# EAGLE design fUENTE 5 VOLTS (EAGLE 5.07)
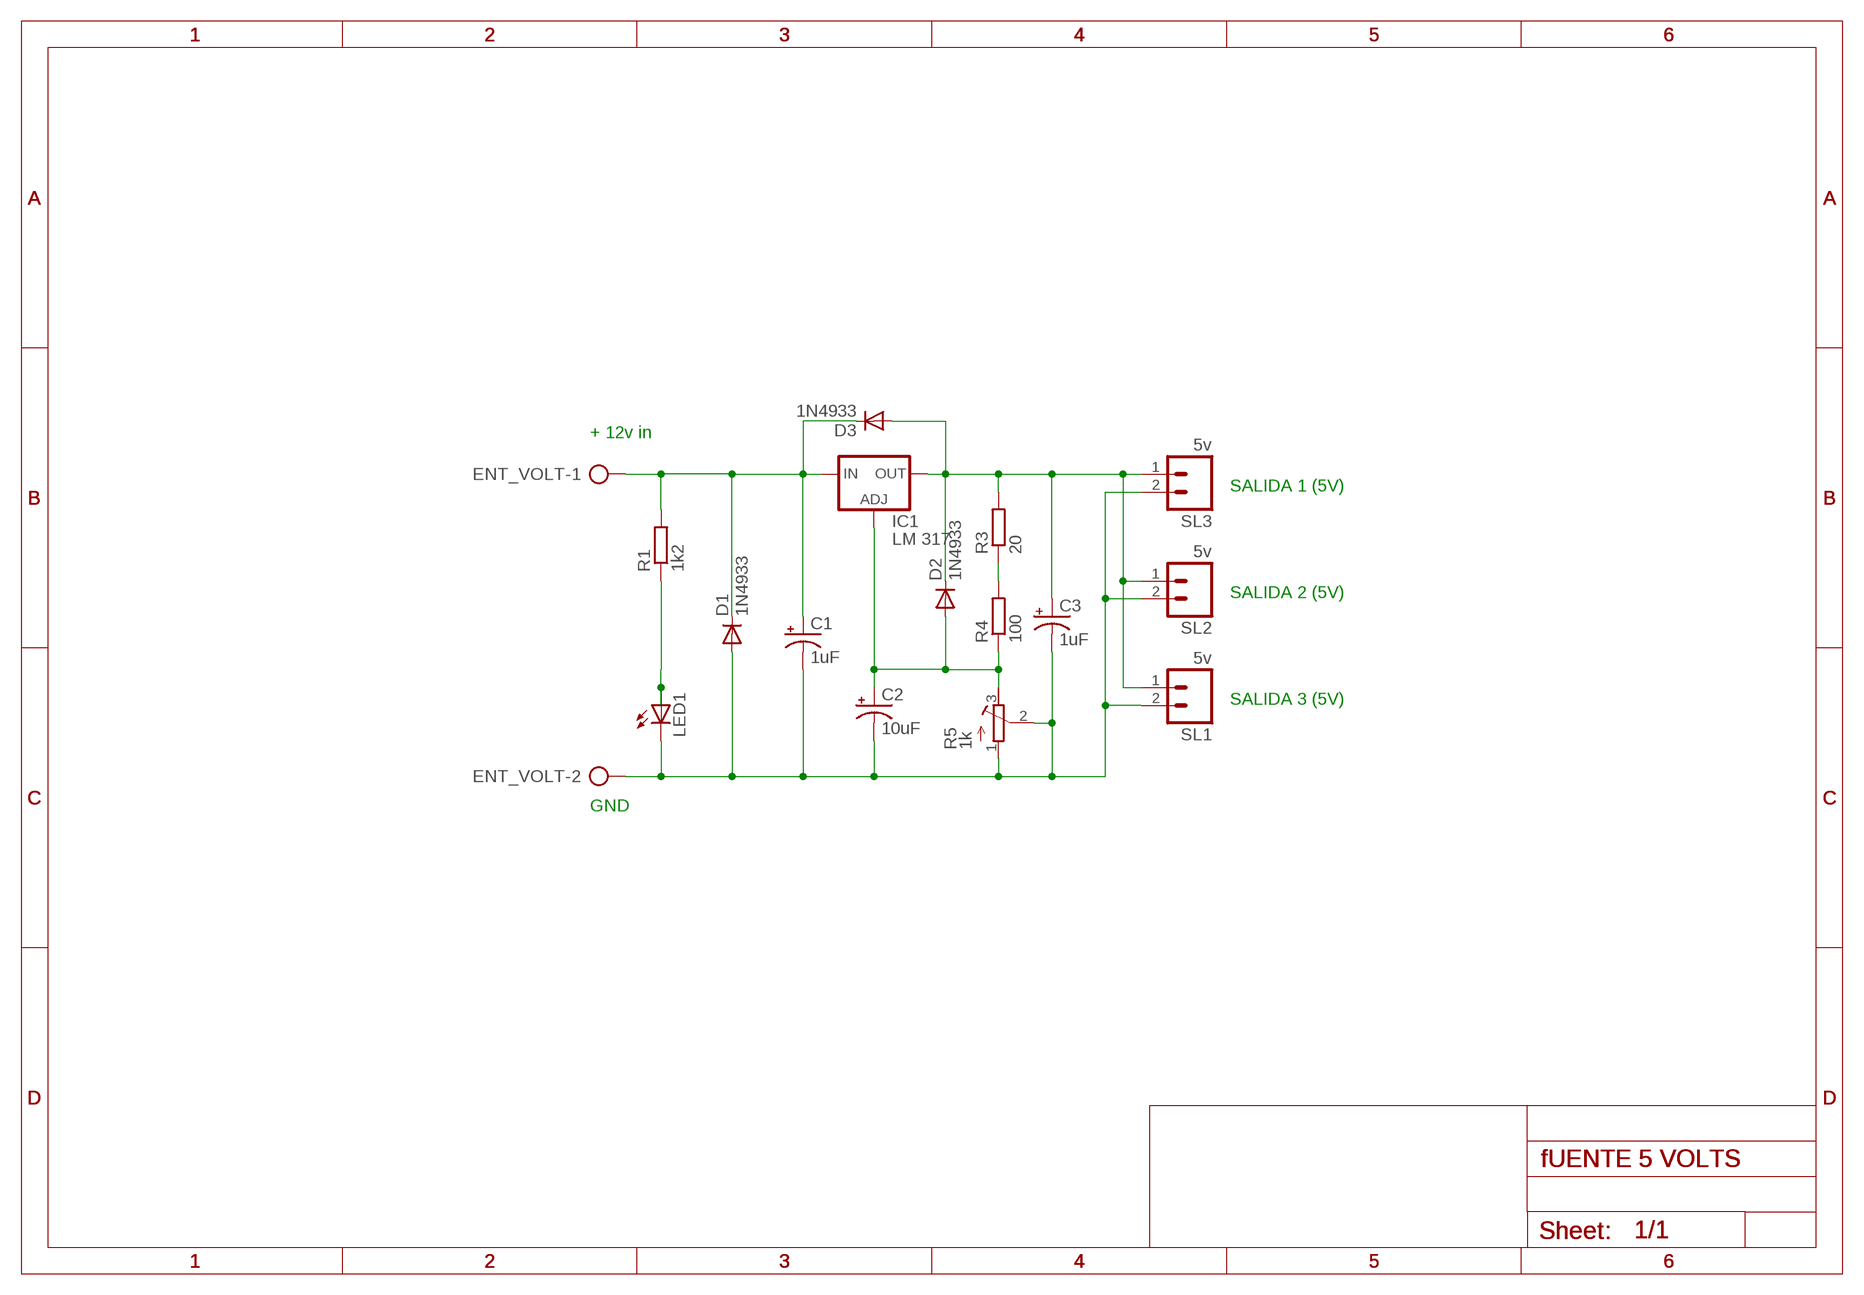
[diagram p0: schematic, sheet 1]

## Parts
C1  1uF  CPOL-USE3.5-8  [E3,5-8]
C2  10uF  CPOL-USE3.5-8  [E3,5-8]
C3  1uF  CPOL-USE3.5-8  [E3,5-8]
D1  1N4933  [DO41-10]
D2  1N4933  [DO41-10]
D3  1N4933  [DO41-10]
ENT_VOLT  AK300/2  [AK300/2]
IC1  LM 317  LM317-TO3  [TO3-K02]
LED1  LED3MM  [LED3MM]
R1  1k2  R-EU_0207/10  [0207/10]
R3  20  R-EU_0207/10  [0207/10]
R4  100  R-EU_0207/10  [0207/10]
R5  1k  R-TRIMM64W  [RTRIM64W]
SL1  5v  M02  [02P]
SL2  5v  M02  [02P]
SL3  5v  M02  [02P]

## Nets
5V: C3.+ D2.C D3.A IC1.3(OUT) R3.2 SL1.1 SL2.1 SL3.1
12V: C1.+ D1.C D3.C ENT_VOLT.1 IC1.1(IN) R1.2
ADJ: C2.+ D2.A IC1.2(ADJ) R4.1 R5.3(A)
GND: C1.- C2.- C3.- D1.A ENT_VOLT.2 LED1.K(C) R5.1(E) R5.2(S) SL1.2 SL2.2 SL3.2
N$1: R3.1 R4.2
N$4: LED1.A R1.1

## Notes on the sheet
- + 12v in
- SALIDA 1 (5V)
- SALIDA 2 (5V)
- SALIDA 3 (5V)
- GND

## Library data of the parts
C1-C3 = rcl:CPOL-US: POLARIZED CAPACITOR, American symbol
D1-D3 = diode:1N4933: DIODE fast recovery rectifier, 1A
ENT_VOLT = con-ptr500:AK300/2: CONNECTOR
IC1 = v-reg:LM317-TO3: VOLTAGE REGULATOR
LED1 = led:LED: LED OSRAM: - CHIPLED LG R971, LG N971, LY N971, LG Q971, LY Q971, LO R971, LY R971 LH N974, LH R974 LS Q976, LO Q976, LY Q976 LO Q996 - Hyper CHIPLED LW Q18S LB Q993, LB Q99A, LB R99A - SideLED LS A670, LO A670, LY A670, LG A670, LP A670 LB A673, LV A673, LT A673, LW A673 LH A674 LY A675 LS A676, LA A676, LO A676, LY A676, LW A676 LS A679, LY A679, LG A679 - Hyper Micro SIDELED® LS Y876, LA Y876, LO Y876, LY Y876 LT Y87S - SmartLED LW L88C, LW L88S LB L89C, LB L89S, LG L890 LS L89K, LO L89K, LY L89K LS L896, LA L896, LO L896, LY L896 - TOPLED LS T670, LO T670, LY T670, LG T670, LP T670 LSG T670, LSP T670, LSY T670, LOP T670, LYG T670 LG T671, LOG T671, LSG T671 LB T673, LV T673, LT T673, LW T673 LH T674 LS T676, LA T676, LO T676, LY T676, LB T676, LH T676, LSB T676, LW T676 LB T67C, LV T67C, LT T67C, LS T67K, LO T67K, LY T67K, LW E67C LS E67B, LA E67B, LO E67B, LY E67B, LB E67C, LV E67C, LT E67C LW T67C LS T679, LY T679, LG T679 LS T770, LO T770, LY T770, LG T770, LP T770 LB T773, LV T773, LT T773, LW T773 LH T774 LS E675, LA E675, LY E675, LS T675 LS T776, LA T776, LO T776, LY T776, LB T776 LHGB T686 LT T68C, LB T68C - Hyper Mini TOPLED® LB M676 - Mini TOPLED Santana® LG M470 LS M47K, LO M47K, LY M47K Source: http://www.osram.convergy.de LUXEON: - LUMILED® LXK2-PW12-R00, LXK2-PW12-S00, LXK2-PW14-U00, LXK2-PW14-V00 LXK2-PM12-R00, LXK2-PM12-S00, LXK2-PM14-U00 LXK2-PE12-Q00, LXK2-PE12-R00, LXK2-PE12-S00, LXK2-PE14-T00, LXK2-PE14-U00 LXK2-PB12-K00, LXK2-PB12-L00, LXK2-PB12-M00, LXK2-PB14-N00, LXK2-PB14-P00, LXK2-PB14-Q00 LXK2-PR12-L00, LXK2-PR12-M00, LXK2-PR14-Q00, LXK2-PR14-R00 LXK2-PD12-Q00, LXK2-PD12-R00, LXK2-PD12-S00 LXK2-PH12-R00, LXK2-PH12-S00 LXK2-PL12-P00, LXK2-PL12-Q00, LXK2-PL12-R00 Source: www.luxeon.com KINGBRIGHT: KA-3528ASYC Source: www.kingbright.com
R1 R3 R4 = rcl:R-EU_: RESISTOR, European symbol
R5 = rcl:R-TRIMM: Trimm resistor
SL1-SL3 = con-amp-quick:M02: AMP QUICK CONNECTOR

## Board
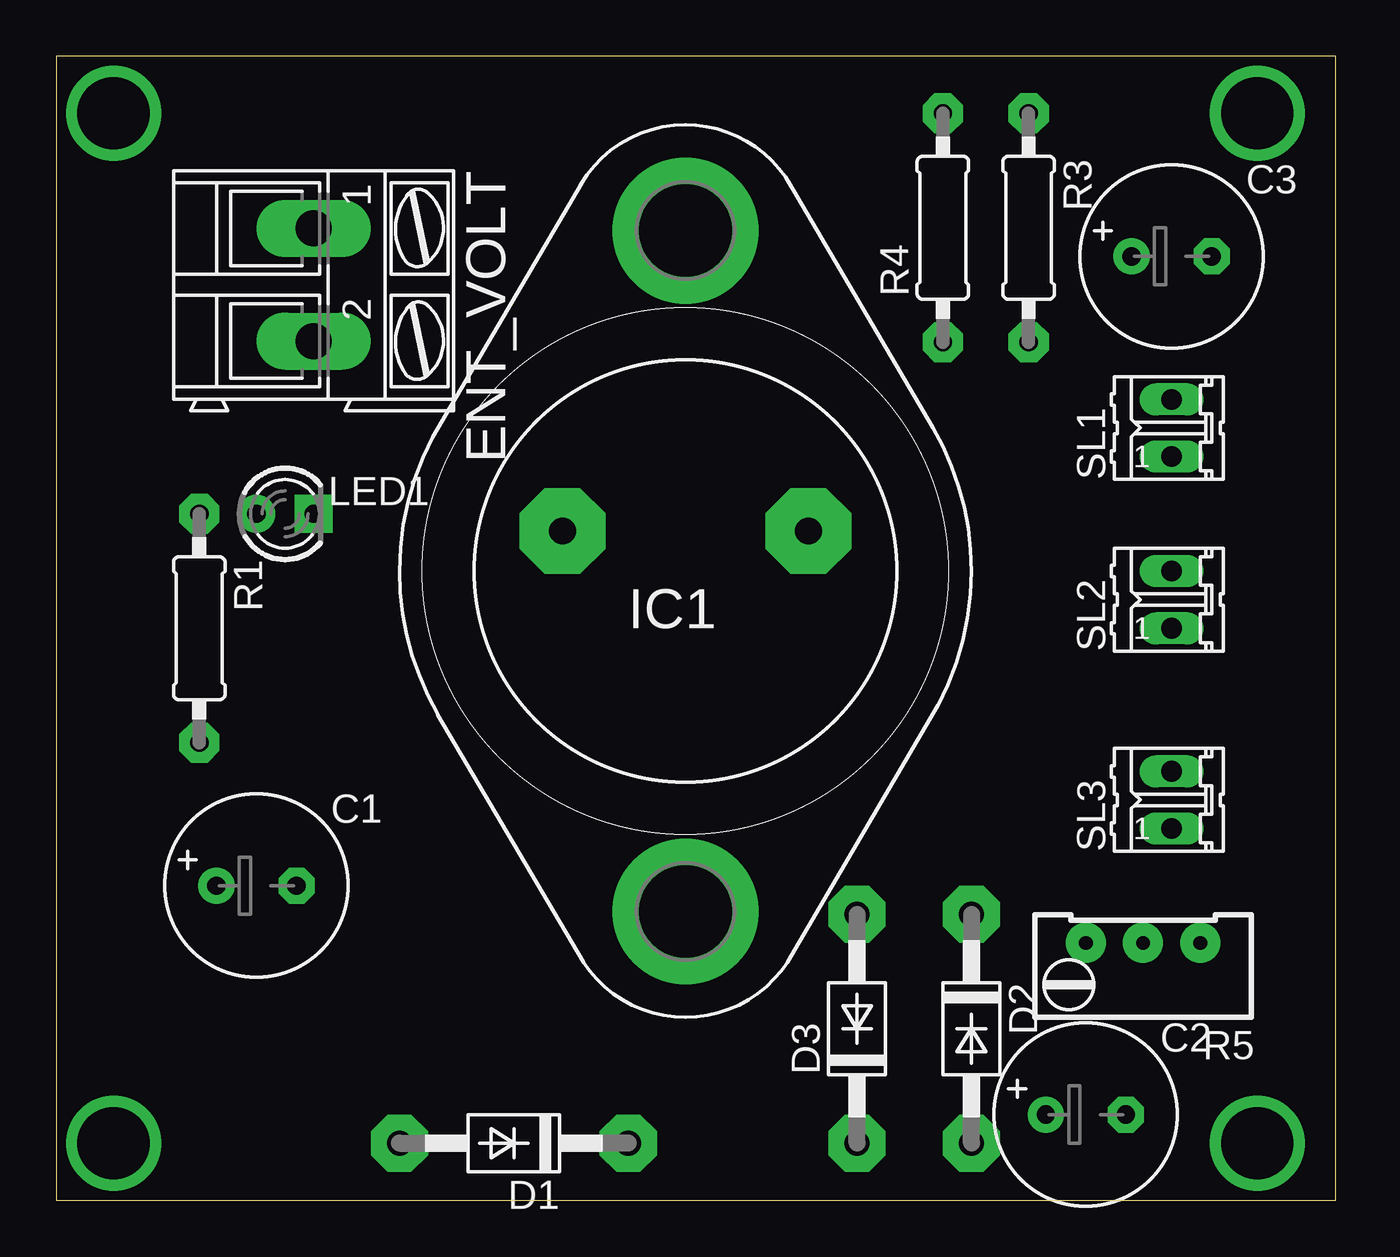
[diagram p1: board, top side]
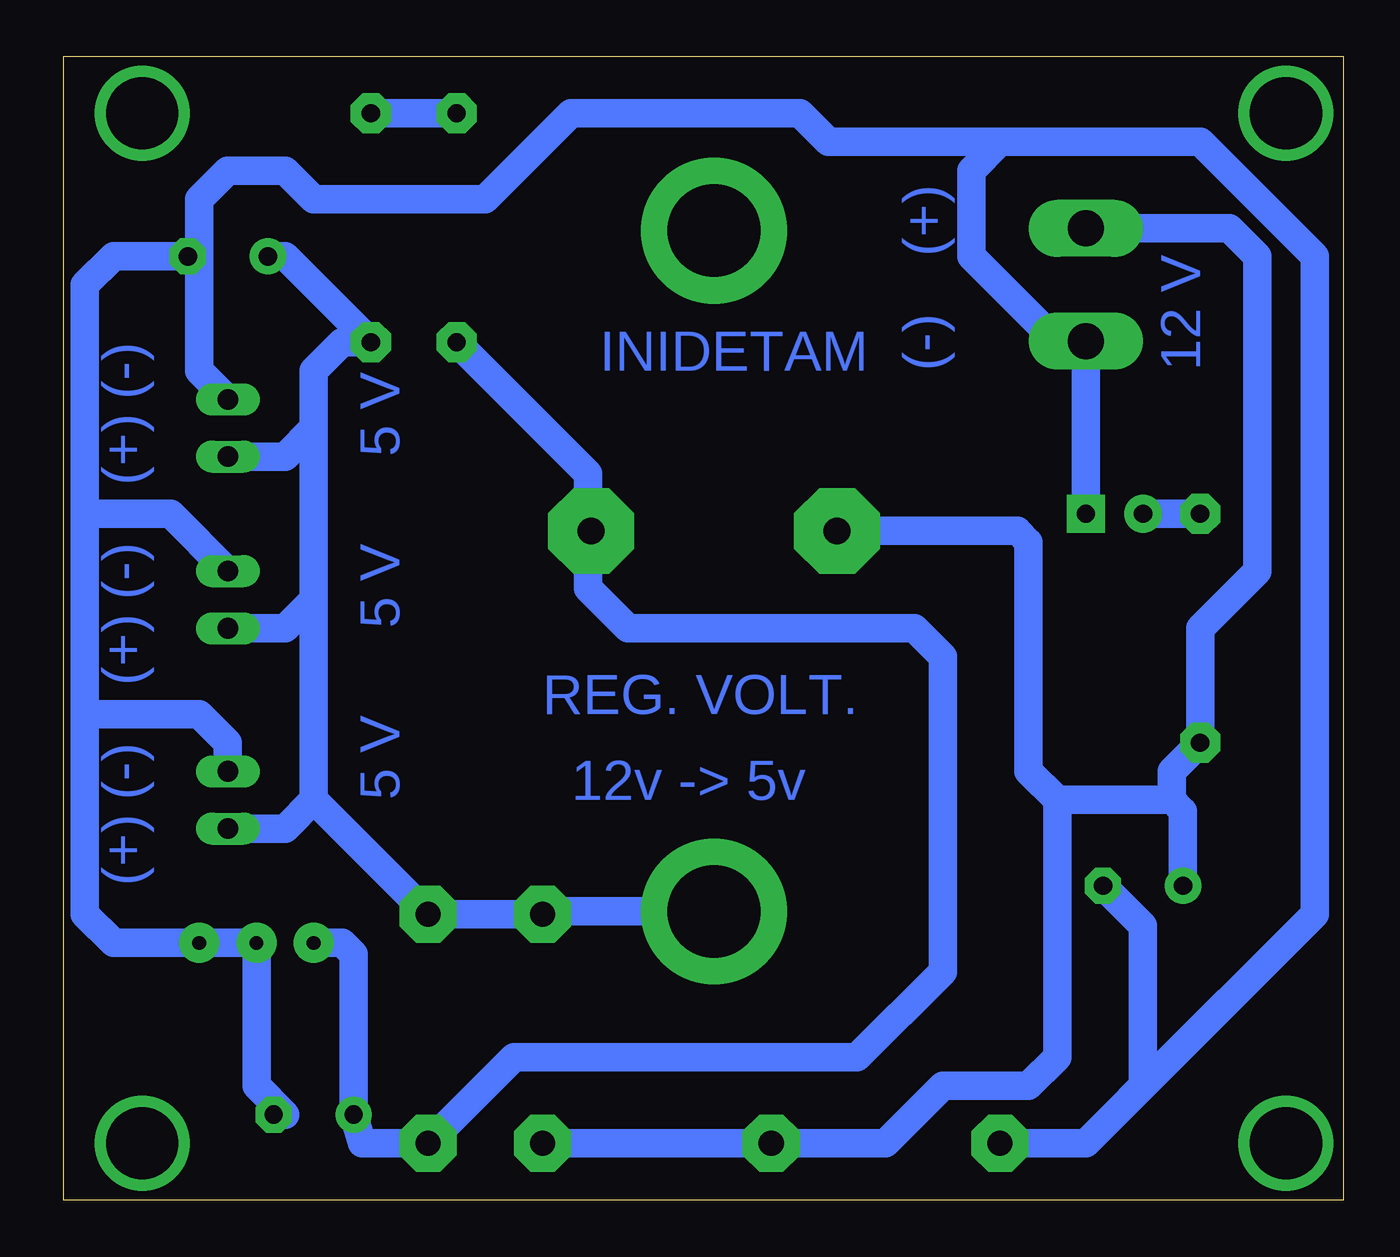
[diagram p2: board, bottom side, seen from below]

Size 56.82 x 50.79 mm. Coordinates in mm from the lower left corner, seen from the top.
Outline: 0,0 56.82,0 56.82,50.79 0,50.79 0,0
Copper layers (1*16): Top 0.035mm / dielectric 1.5mm / Bottom 0.035mm
Design rules "default *": minimum track width 10mil, minimum drill 24mil, track to track 8mil, track to pad 8mil, pad to pad 8mil, via to via 8mil, smd to smd 8mil, copper to edge 40mil, drill to drill 8mil, minimum pad ring 10mil, minimum via ring 8mil, stop-mask expansion 4mil, vias tented up to drill 0mil, thermal gap 10mil

### Footprints (pad centres in the part's own frame; a part is rotated, then mirrored left to right if it is on the bottom)
E3,5-8 = drill 0.813 pad 1.6 round: + -1.778,0 | drill 0.813 pad 1.6 octagon: - 1.778,0
DO41-10 = drill 1.118 pad 2.54 octagon: A 5.08,0; C -5.08,0
AK300/2 = drill 1.6 pad 2.54 long: 1 -2.515,0; 2 2.489,0
TO3-K02 = drill 1.194 pad 3.81 octagon: 1 -1.778,-5.461; 2 -1.778,5.461 | drill 4.115 pad 6.477 round: 3 15.113,0; 3@ -15.113,0
LED3MM = drill 0.813 pad 1.676 round: A -1.27,0 | drill 0.813 pad 1.676 square: K 1.27,0
0207/10 = drill 0.813 pad 1.778 octagon: 1 -5.08,0; 2 5.08,0
RTRIM64W = drill 0.61 pad 1.778 round: 1 1.27,-2.54; 2 1.27,0; 3 1.27,2.54
02P = drill 0.914 long: 1 -1.27,0; 2 1.27,0

### Placement (x,y rotation side)
C1  8.89,13.97 0 top
C2  45.72,3.81 0 top
C3  49.53,41.91 0 top
D1  20.32,2.54 180 top
D2  40.64,7.62 270 top
D3  35.56,7.62 90 top
ENT_VOLT  11.43,40.64 270 top
IC1  27.94,27.94 270 top
LED1  10.16,30.48 0 top
R1  6.35,25.4 270 top
R3  43.18,43.18 270 top
R4  39.37,43.18 90 top
R5  48.26,10.16 90 top
SL1  49.53,34.29 90 top
SL2  49.53,26.67 90 top
SL3  49.53,17.78 90 top

### Tracks (layer width: path | path; a pad name or v marks a point on that pad's centre or on a via)
5V
  Bottom 1.27: IC1.3 35.43,12.83 D3.A D2.C 45.72,17.78 | SL1.1 46.99,33.02 45.72,34.29 | SL2.1 46.99,25.4 45.72,26.67 | 45.72,26.67 45.72,34.29 | SL3.1 46.99,16.51 45.72,17.78 | 45.72,17.78 45.72,26.67 | C3.+ 46.99,41.91 R3.2 44.45,38.1 45.72,36.83 45.72,34.29
12V
  Bottom 1.27: ENT_VOLT.1 5.05,43.16 3.81,41.91 3.81,27.94 6.35,25.4 R1.2 7.62,19.05 7.62,17.78 | IC1.1 14.48,29.72 13.97,29.21 13.97,19.05 12.7,17.78 | 12.7,17.78 7.62,17.78 | 12.7,17.78 12.7,6.35 13.97,5.08 17.78,5.08 20.32,2.54 D1.C D3.C | C1.+ 7.11,17.27 7.62,17.78
ADJ
  Bottom 1.27: 33.53,29.72 IC1.2 | 33.53,29.72 33.53,27.18 31.75,25.4 19.05,25.4 17.78,24.13 17.78,10.16 21.59,6.35 36.83,6.35 D2.A 43.56,2.54 C2.+ 43.94,10.92 44.45,11.43 R5.3 | 33.53,29.72 33.53,32.26 R4.1
GND
  Bottom 1.27: C2.- 46.99,3.81 48.26,5.08 R5.2 R5.1 54.61,11.43 55.88,12.7 55.88,21.59 | 11.43,2.54 D1.A 11.43,2.54 | 11.43,2.54 10.16,3.81 8.89,5.08 | 8.89,5.08 8.89,12.19 C1.- | 11.43,38.1 LED1.K 11.43,38.1 | 11.43,38.1 ENT_VOLT.2 | 11.43,38.1 12.7,38.1 15.24,40.64 16.51,41.91 16.51,45.72 15.24,46.99 6.35,46.99 | 1.27,41.91 6.35,46.99 | 1.27,12.7 1.27,41.91 | 8.89,5.08 1.27,12.7 | 55.88,30.48 55.88,21.59 | 55.88,30.48 55.88,40.64 54.61,41.91 C3.- | 50.8,41.91 C3.- | 50.8,41.91 C3.- | 50.8,41.91 50.8,36.83 SL1.2 | SL2.2 52.07,30.48 55.88,30.48 | SL3.2 49.53,20.32 50.8,21.59 55.88,21.59 | 11.43,2.54 1.27,12.7 | 1.27,12.7 1.27,41.91 | 1.27,41.91 6.35,46.99 | 6.35,46.99 22.86,46.99 24.13,48.26 34.29,48.26 38.1,44.45 45.72,44.45 46.99,45.72 49.53,45.72 50.8,44.45 50.8,41.91
N$1
  Bottom 1.27: R4.2 R3.1
N$2  (via drill 3.2 pad 3.81)
  other vias: 2.54,48.26
N$3  (via drill 3.2 pad 3.81)
  other vias: 53.34,48.26
N$4
  Bottom 1.27: R1.1 LED1.A
N$5  (via drill 3.2 pad 3.81)
  other vias: 53.34,2.54
N$6  (via drill 3.2 pad 3.81)
  other vias: 2.54,2.54

### Text on the board
Bottom: (+) | 12 V | (-) | INIDETAM | (-) | 5 V | (+) | (-) | 5 V | (+) | REG. VOLT. | 12v -> 5v | 5 V | (-) | (+)